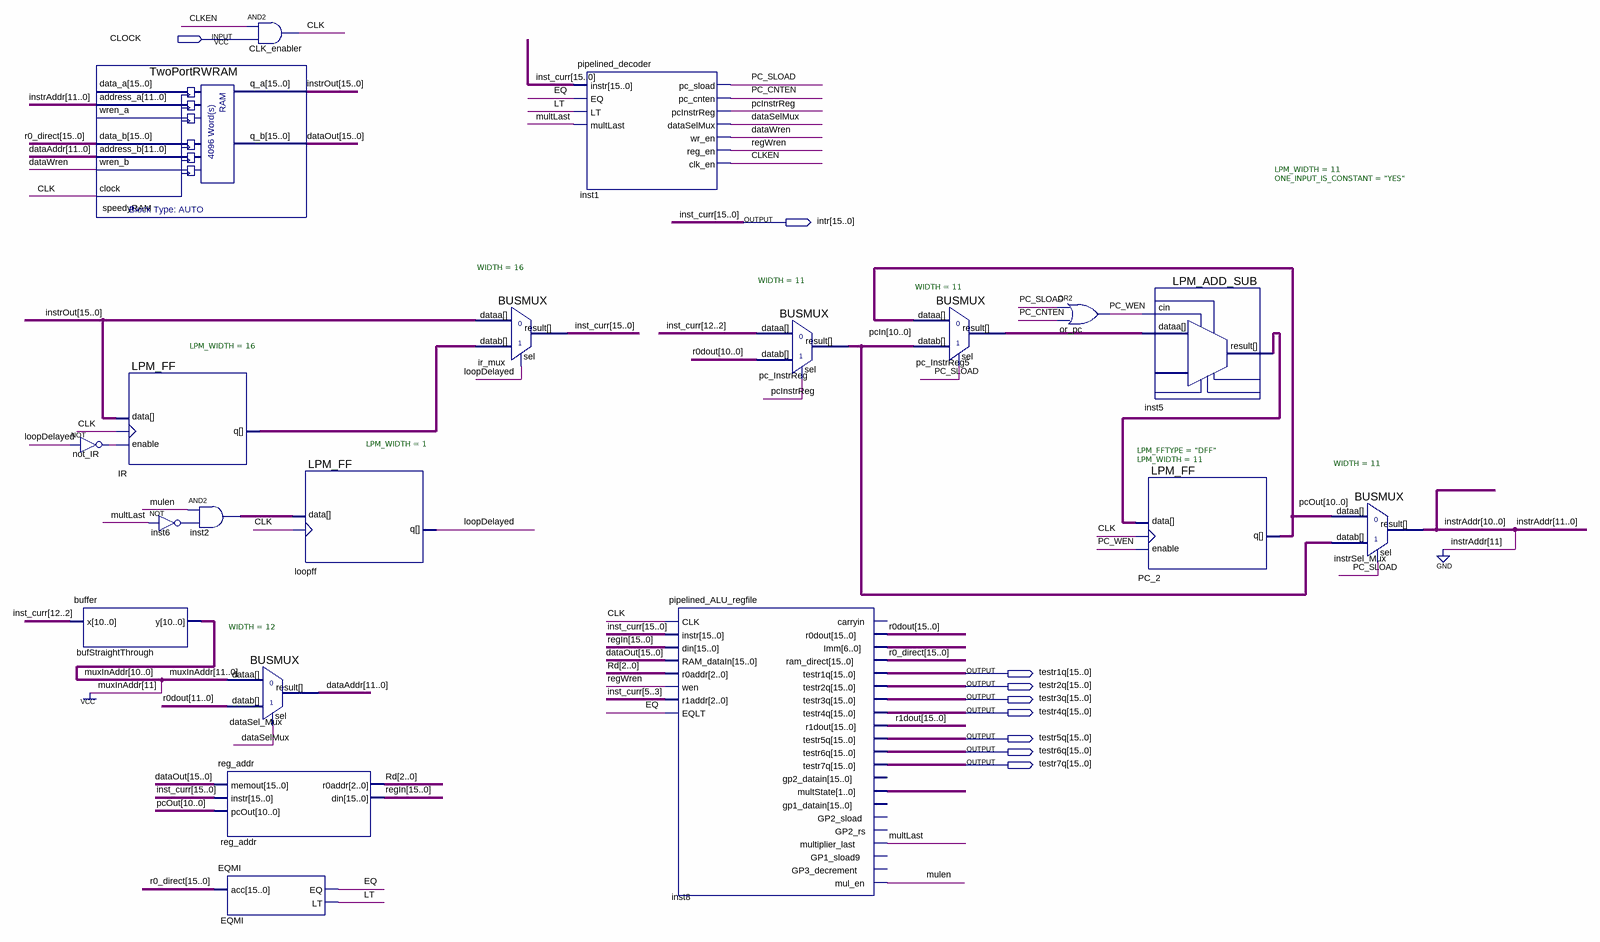
[diagram p0: schematic sheet]
// Quartus schematic lma0_lessout.bdf as structural Verilog: 20 symbols, 9 pins
module lma0_lessout (
  input  CLOCK,
  output [15:0] intr,
  output [15:0] testr1q,
  output [15:0] testr2q,
  output [15:0] testr3q,
  output [15:0] testr4q,
  output [15:0] testr5q,
  output [15:0] testr6q,
  output [15:0] testr7q
);

  wire CLK, CLKEN, dataSelMux, dataWren, EQ, inst2_out, inst6_out, loopDelayed, LT, mulen, multLast,
       not_IR_out, PC_CNTEN, PC_SLOAD, PC_WEN, pcInstrReg, regWren;
  wire [1:0] inst8_multstate;
  wire [2:0] Rd;
  wire [6:0] inst8_imm;
  wire [10:0] inst5_result, instrAddr, muxInAddr, pc_InstrReg5_result, pcIn, pcOut;
  wire [11:0] dataAddr;
  wire [15:0] dataOut, instrOut, IR_q, r0_direct, r0dout, r1dout, regIn;

  not not_IR (not_IR_out, loopDelayed);
  buffer bufStraightThrough (.x(intr[12:2]), .y(muxInAddr));
  TwoPortRWRAM speedyRAM (
    .address_a({1'b0, instrAddr}), .data_b(r0_direct), .address_b(dataAddr), .wren_b(dataWren), .clock(CLK),
    .q_a(instrOut), .q_b(dataOut));  // open: data_a, wren_a
  LPM_FF #(.LPM_WIDTH(16)) IR (.enable(not_IR_out), .clock(CLK), .data(instrOut), .q(IR_q));
  not inst6 (inst6_out, multLast);
  and inst2 (inst2_out, mulen, inst6_out);
  BUSMUX #(.WIDTH(12)) dataSel_Mux (
    .datab(r0dout[11:0]), .sel(dataSelMux), .dataa({1'b1, muxInAddr}), .result(dataAddr));
  reg_addr reg_addr (.memout(dataOut), .instr(intr), .pcOut(pcOut), .r0addr(Rd), .din(regIn));
  EQMI EQMI (.acc(r0_direct), .EQ(EQ), .LT(LT));
  and CLK_enabler (CLK, CLKEN, CLOCK);
  LPM_FF #(.LPM_WIDTH(1)) loopff (.clock(CLK), .data(inst2_out), .q(loopDelayed));
  BUSMUX #(.WIDTH(16)) ir_mux (.datab(IR_q), .sel(loopDelayed), .dataa(instrOut), .result(intr));
  pipelined_decoder inst1 (
    .instr(intr), .EQ(EQ), .LT(LT), .multLast(multLast), .pc_sload(PC_SLOAD), .pc_cnten(PC_CNTEN),
    .pcInstrReg(pcInstrReg), .dataSelMux(dataSelMux), .wr_en(dataWren), .reg_en(regWren), .clk_en(CLKEN));
  pipelined_ALU_regfile inst8 (
    .CLK(CLK), .instr(intr), .din(regIn), .RAM_dataIn(dataOut), .r0addr(Rd), .wen(regWren),
    .r1addr(intr[5:3]), .EQLT(EQ), .r0dout(r0dout), .Imm(inst8_imm), .ram_direct(r0_direct),
    .testr1q(testr1q), .testr2q(testr2q), .testr3q(testr3q), .testr4q(testr4q), .r1dout(r1dout),
    .testr5q(testr5q), .testr6q(testr6q), .testr7q(testr7q), .multState(inst8_multstate),
    .multiplier_last(multLast), .mul_en(mulen));  // open: carryin, gp2_datain, gp1_datain, GP2_sload, GP2_rs, GP1_sload9, GP3_decrement
  BUSMUX #(.WIDTH(11)) pc_InstrReg (.datab(r0dout[10:0]), .sel(pcInstrReg), .dataa(intr[12:2]), .result(pcIn));
  BUSMUX #(.WIDTH(11)) pc_InstrReg5 (.datab(pcIn), .sel(PC_SLOAD), .dataa(pcOut), .result(pc_InstrReg5_result));
  or or_pc (PC_WEN, PC_SLOAD, PC_CNTEN);
  LPM_ADD_SUB #(.LPM_WIDTH(11), .ONE_INPUT_IS_CONSTANT("YES")) inst5 (
    .cin(PC_WEN), .dataa(pc_InstrReg5_result), .result(inst5_result));
  LPM_FF #(.LPM_FFTYPE("DFF"), .LPM_WIDTH(11)) PC_2 (.enable(PC_WEN), .clock(CLK), .data(inst5_result), .q(pcOut));
  BUSMUX #(.WIDTH(11)) instrSel_Mux (.datab(pcIn), .sel(PC_SLOAD), .dataa(pcOut), .result(instrAddr));

  // Other names for the same wires on the sheet: inst_curr[15:0] = intr
endmodule
